# Altium schematic sheet TCAN1146_PINOUT.SchDoc
size A4; SheetNumber: 9; SheetTotal: 11
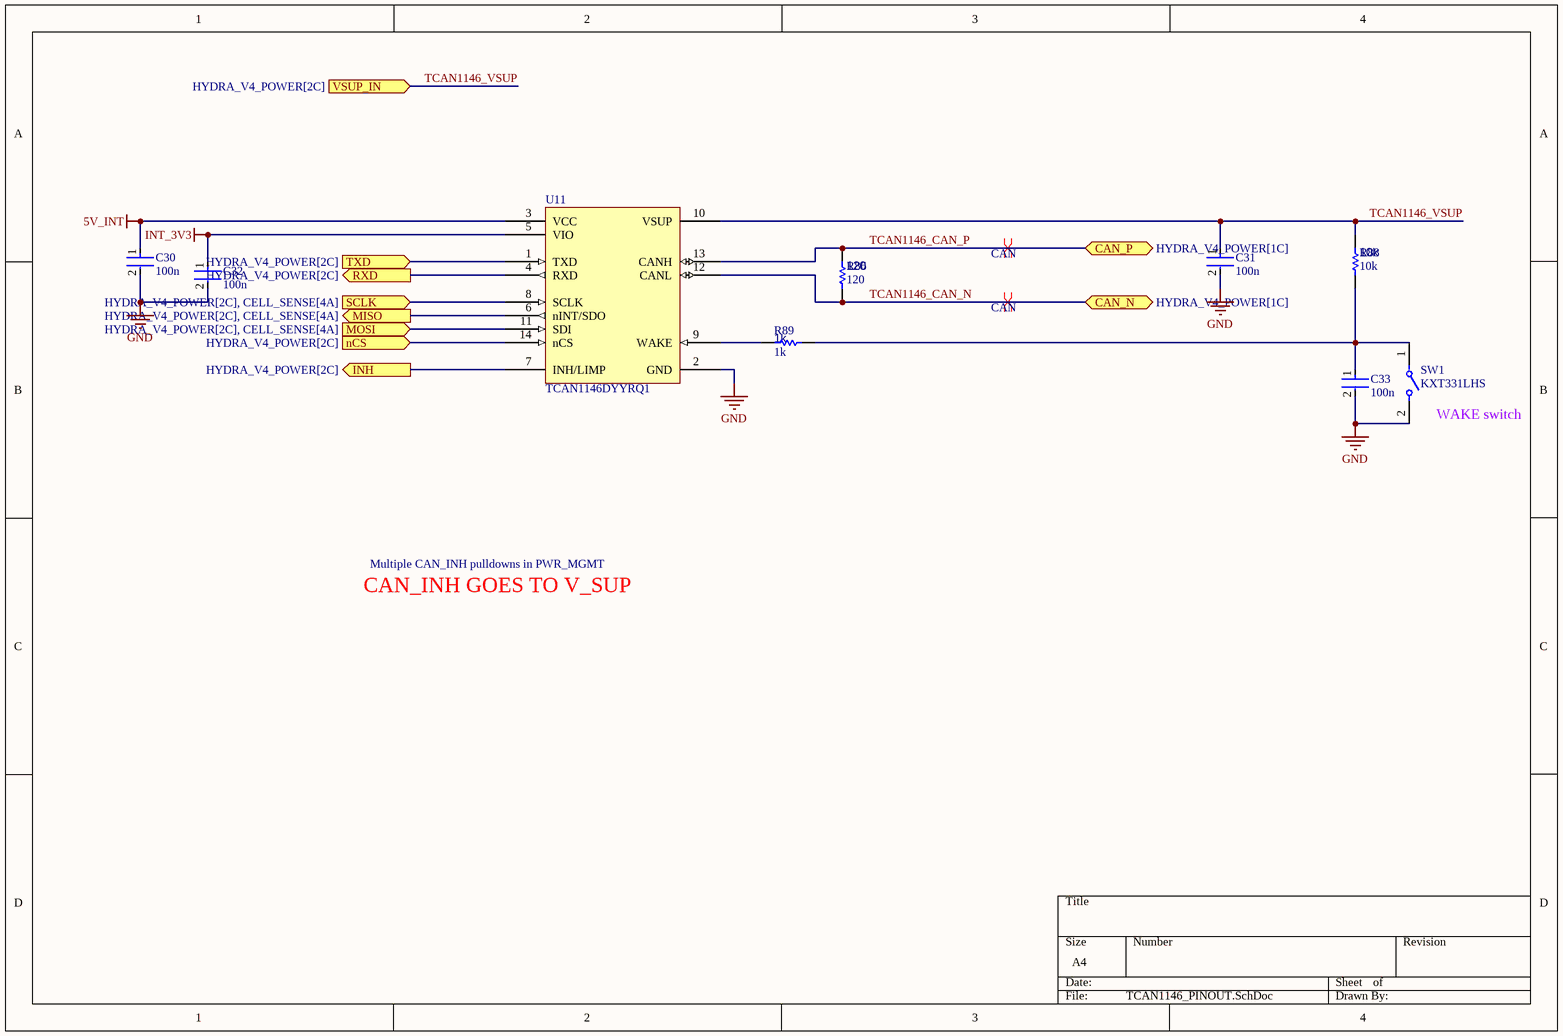
[diagram p0: TCAN1146_PINOUT.SchDoc]

## Parts
C30  100n  [FP-0402-L_1_0_0_05-W_0_5-IPC_A]
C31  100n  [FP-0402-L_1_0_0_05-W_0_5-IPC_A]
C32  100n  [FP-0402-L_1_0_0_05-W_0_5-IPC_A]
C33  100n  [FP-0402-L_1_0_0_05-W_0_5-IPC_A]
R86  120  [R0603B]
R88  10k  [R0603B]
R89  1k  [R0603B]
SW1  KXT331LHS  [FP-KXT331LHS-MFG]
U11  TCAN1146DYYRQ1  [TCAN1146DYYRQ1-Footprint-1]

## Ports
CAN_N (bidir, see HYDRA_V4_POWER[1C]), CAN_P (bidir, see HYDRA_V4_POWER[1C]), INH (out, see HYDRA_V4_POWER[2C]), MISO (out, see HYDRA_V4_POWER[2C], CELL_SENSE[4A]), MOSI (in, see HYDRA_V4_POWER[2C], CELL_SENSE[4A]), nCS (in, see HYDRA_V4_POWER[2C]), RXD (out, see HYDRA_V4_POWER[2C]), SCLK (in, see HYDRA_V4_POWER[2C], CELL_SENSE[4A]), TXD (in, see HYDRA_V4_POWER[2C]), VSUP_IN (in, see HYDRA_V4_POWER[2C])

## Nets
5V_INT: C30.1 U11.3(VCC)
GND: C30.2 C31.2 C32.2 C33.2 SW1.2 U11.2(GND)
INT_3V3: C32.1 U11.5(VIO)
INH: U11.7(INH/LIMP) ; port INH
MISO: U11.6(nINT/SDO) ; port MISO
MOSI: U11.11(SDI) ; port MOSI
nCS: U11.14(nCS) ; port nCS
RXD: U11.4(RXD) ; port RXD
SCLK: U11.8(SCLK) ; port SCLK
TCAN1146_CAN_N: R86.1 U11.12(CANL) ; port CAN_N
TCAN1146_CAN_P: R86.2 U11.13(CANH) ; port CAN_P
TCAN1146_VSUP: C31.1 R88.2 U11.10(VSUP) ; port VSUP_IN
TXD: U11.1(TXD) ; port TXD
NetC33_1: C33.1 R88.1 R89.1 SW1.1
NetR89_2: R89.2 U11.9(WAKE)

## Layout directives
differential pair; differential pair class CAN: TCAN1146_CAN_N, TCAN1146_CAN_P

## Notes on the sheet
- (near SW1) WAKE switch
- Multiple CAN_INH pulldowns in PWR_MGMT
- CAN_INH GOES TO V_SUP

## Library data of the parts
C30-C33 = CMP-001-00058-1: LARGE PADS, 0402 CAP, CHANGE COMMENT TO MATCH REAL P/N; Capacitor Type: Ceramic; Value: 100n; Min Operating Temperature: -55°C; Mounting Technology: Surface Mount; Pins: 2; Case/Package: 0402; RoHS Compliant: Yes; Max Operating Temperature: 85°C
R86 R88 R89 = CMP-009-00002-14: Resistor
  R86: Value: 120
  R88: Value: 10k
  R89: Value: 1k
SW1 = CMP-10040-000029-1: SWITCH TACTILE SPST-NO 0.02A 15V; Operating Force: 240gf; Switch Travel: 0.13mm; Illumination Type: Non-Illuminated; Throw Configuration: SPST; Number of Ports: 1; Current Rating: 5A; Mechanical Life: 500000Cycles; Switch Function: Off-Mom; Connector Type: USB; Actuator Type: Standard; Gender: Receptacle; Number of Contacts: 24; Contact Plating: Gold; Insulation Color: Black; Min Operating Temperature: -40°C; Packaging: Tape and Reel; Flammability Rating: UL94 V-0; Max Operating Temperature: 85°C; Termination: Solder; Mount: Surface Mount
U11 = CMP-318-000000-2: Automotive CAN FD transceiver with watchdog, bus diagnostics and partial networking via sele 14-SOT-23-THIN -40 to 150; Component Type: Standard; Design Item ID: CMP-015-00012-2; Pin Count: 14; Source: TCAN1146DYYRQ1.SchLib